# Altium schematic sheet MCU.SchDoc
size 420 x 297 mm; Address1: Address1; Address2: Address2; Address3: Address3; Address4: Address4; DocumentNumber: АБВГ.123456.001 Э3; SheetNumber: 2; Scale: 1:1; DocumentType: Схема электрическая принципиальная; FirstReferrence: АБВГ.123456.001
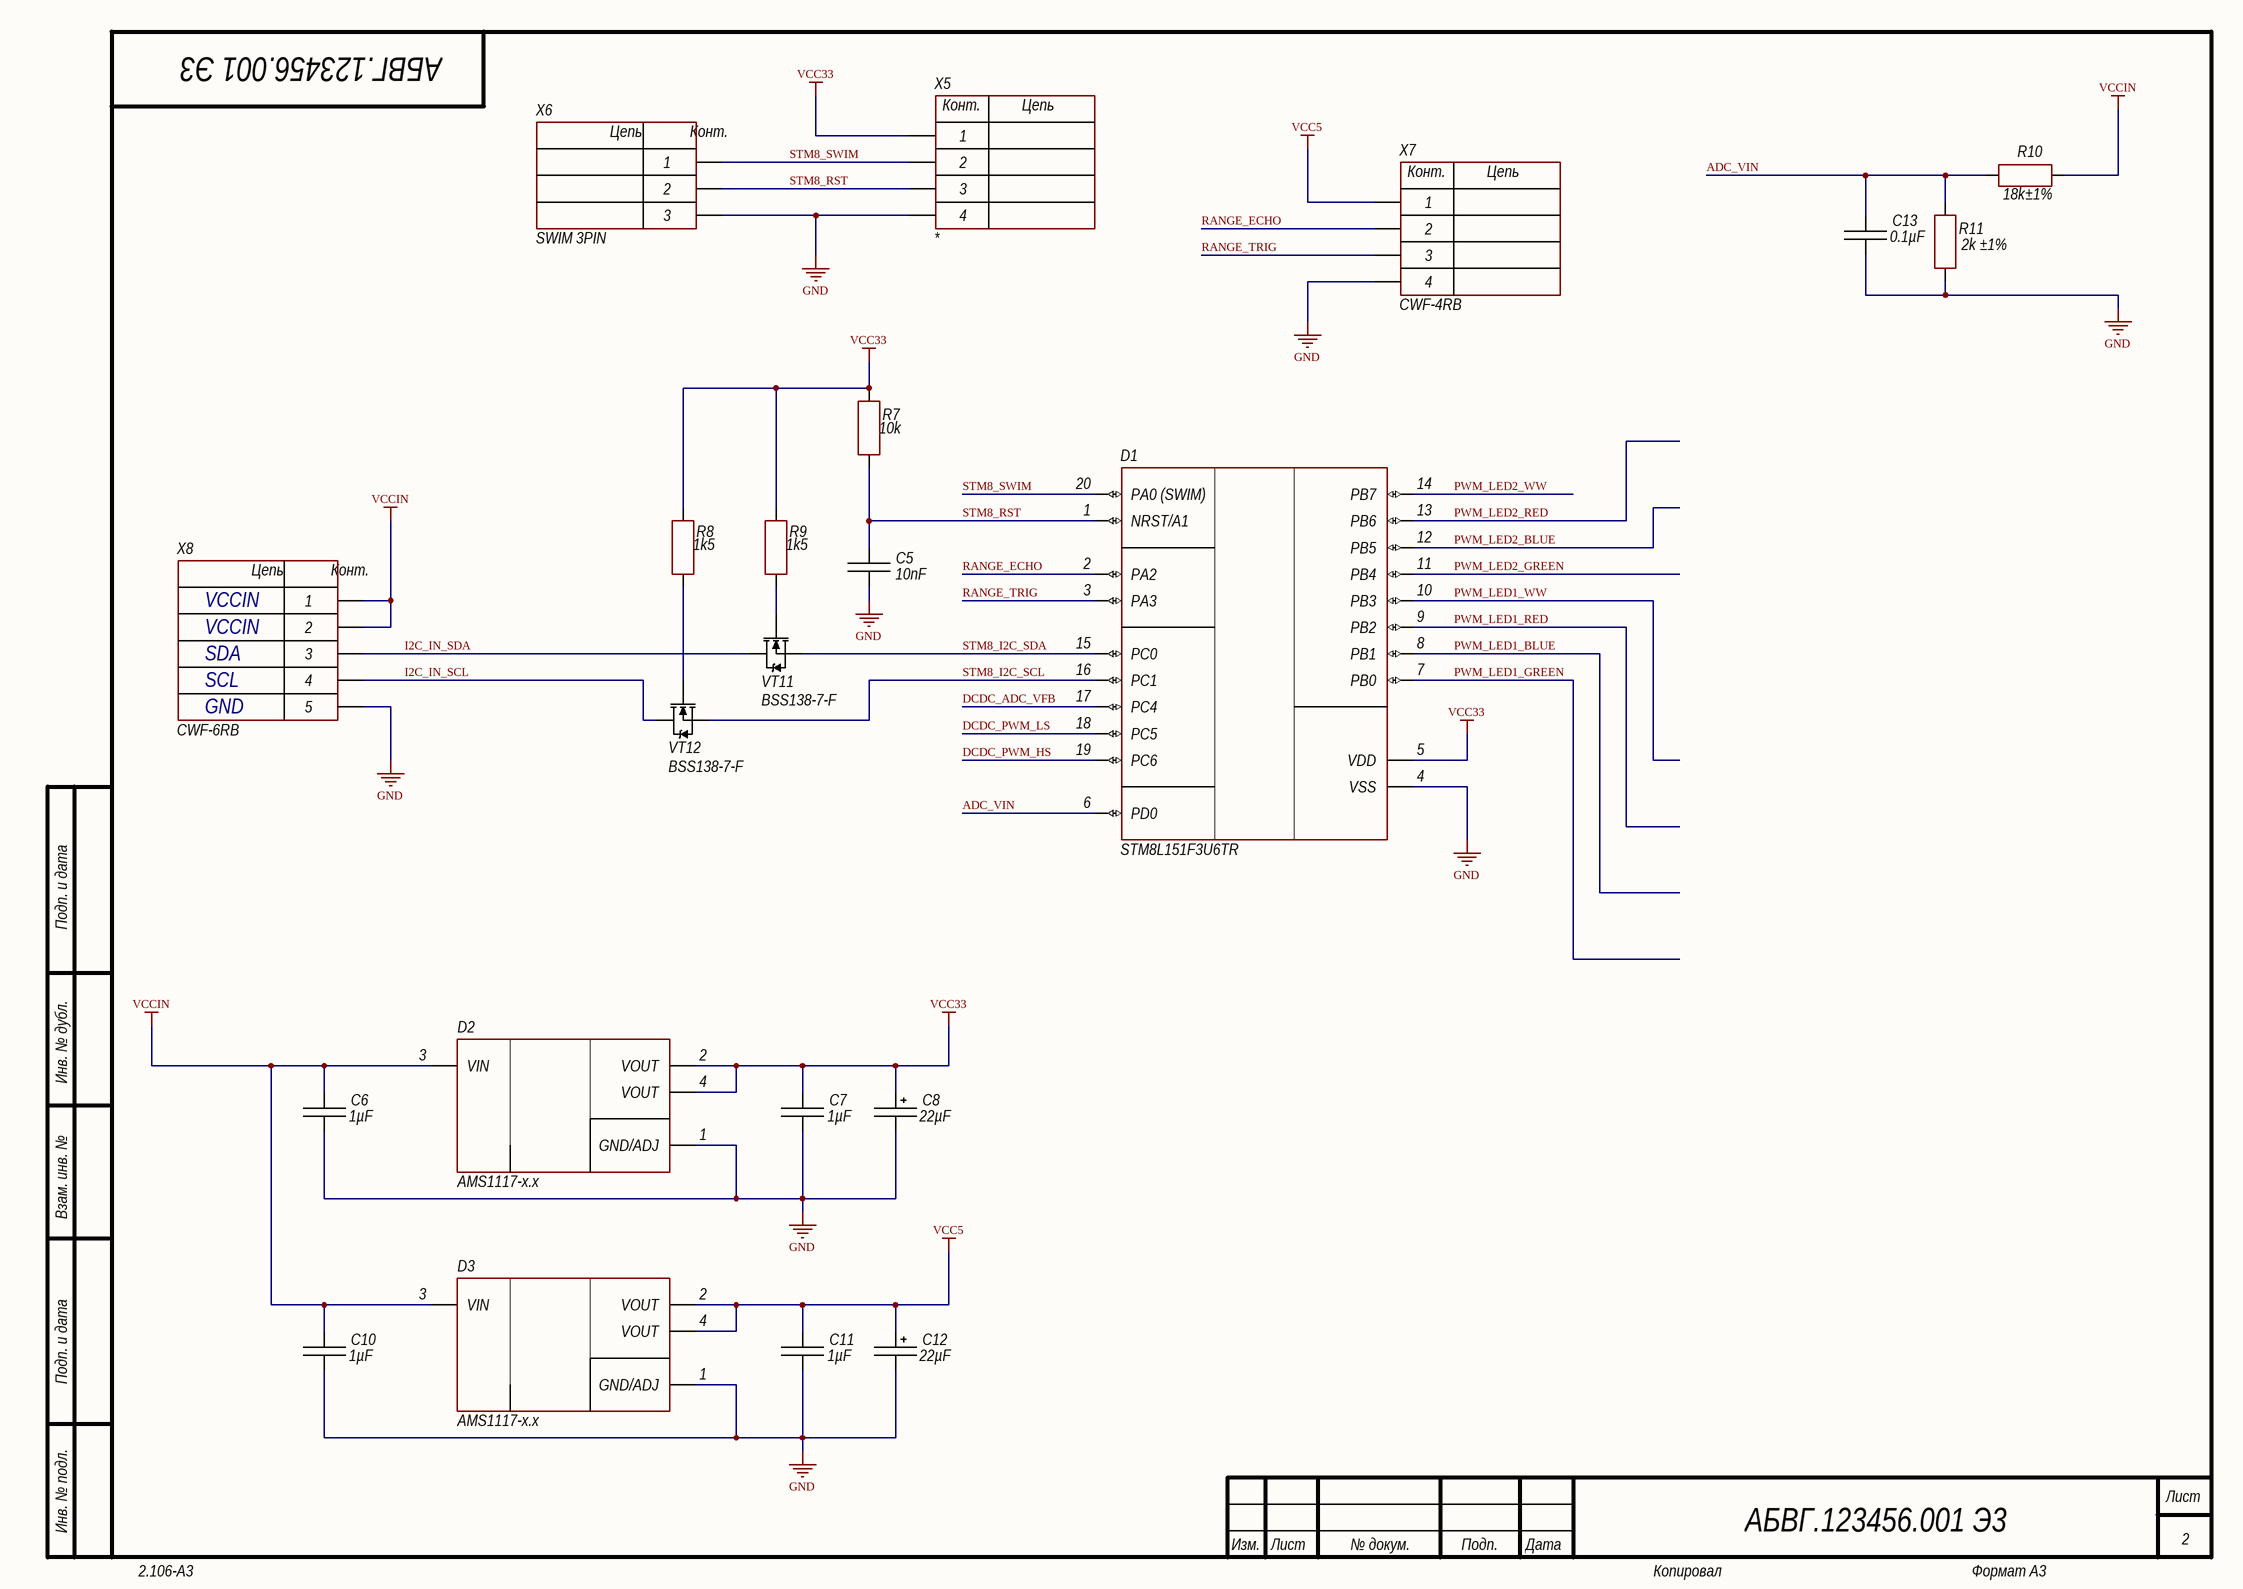
[diagram p0: MCU.SchDoc]

## Parts
C5  10nF  [CH0603C]
C6  1µF  [CH0603C]
C7  1µF  [CH0603C]
C8  22µF  [TANTAL_B]
C10  1µF  [CH0603C]
C11  1µF  [CH0603C]
C12  22µF  [TANTAL_B]
C13  0.1µF  [CH0603C]
D1  STM8L151F3U6TR  [20-UFQFPN]
D2  AMS1117-x.x  [SOT223]
D3  AMS1117-x.x  [SOT223]
R7  10k  [CH0603R]
R8  1k5  [CH0603R]
R9  1k5  [CH0603R]
R10  18k  ComponentKind: ±1%  [CH0603R]
R11  2k  ComponentKind: ±1%  [CH0603R]
VT11  BSS138-7-F  [SOT23_132]
VT12  BSS138-7-F  [SOT23_132]
X5  *  [CON: CWF-4RB]
X6  SWIM 3PIN  [CON: 3 PIN 1x1]
X7  CWF-4RB  [CON: CWF-4RB]
X8  CWF-6RB  [CON: CWF-5RB]

## Nets
GND: C5.1 C6.1 C7.1 C8.2 C10.1 C11.1 C12.2 C13.2 D1.4(VSS) D2.1(GND/ADJ) D3.1(GND/ADJ) R11.1 X5.4 X6.3 X7.4 X8.5
VCC5: C11.2 C12.1 D3.2(VOUT) D3.4(VOUT) X7.1
VCC33: C7.2 C8.1 D1.5(VDD) D2.2(VOUT) D2.4(VOUT) R7.2 R8.2 R9.2 X5.1
VCCIN: C6.2 C10.2 D2.3(VIN) D3.3(VIN) R10.2 X8.1 X8.2
ADC_VIN: C13.1 D1.6(PD0) R10.1 R11.2
DCDC_ADC_VFB: D1.17(PC4)
DCDC_PWM_HS: D1.19(PC6)
DCDC_PWM_LS: D1.18(PC5)
I2C_IN_SCL: VT12.2(D) X8.4
I2C_IN_SDA: VT11.2(D) X8.3
PWM_LED1_BLUE: D1.8(PB1)
PWM_LED1_GREEN: D1.7(PB0)
PWM_LED1_RED: D1.9(PB2)
PWM_LED1_WW: D1.10(PB3)
PWM_LED2_BLUE: D1.12(PB5)
PWM_LED2_GREEN: D1.11(PB4)
PWM_LED2_RED: D1.13(PB6)
PWM_LED2_WW: D1.14(PB7)
RANGE_ECHO: D1.2(PA2) X7.2
RANGE_TRIG: D1.3(PA3) X7.3
STM8_I2C_SCL: D1.16(PC1) VT12.3(S)
STM8_I2C_SDA: D1.15(PC0) VT11.3(S)
STM8_RST: C5.2 D1.1(NRST/A1) R7.1 X5.3 X6.2
STM8_SWIM: D1.20(PA0_(SWIM)) X5.2 X6.1
NetR8_1: R8.1 VT12.1(G)
NetR9_1: R9.1 VT11.1(G)

## Notes on the sheet
- VCCIN
- SDA
- SCL
- GND
- Подп. и дата
- Инв. № дубл.
- Взам. инв. №
- Инв. № подл.
- Изм.
- Лист
- № докум.
- Подп.
- Дата
- 2.106-A3
- Копировал
- Формат А3
- (in symbol 3-Connector) Цепь; Конт.
- (in symbol 4-Connector) Конт.; Цепь
- (in symbol 5-Connector) Цепь; Конт.

## Library data of the parts
C5 C13 = Capacitor: Manufacturer: *; Model: *; HelpURL: *; ComponentKind: *
  C5: Value: 10nF
  C13: Value: 0.1µF
C6 C7 C10 C11 = Capacitor: Manufacturer: Murata Electronics Inc.; Model: GRM188R71C105KE15D; HelpURL: https://www.terraelectronica.ru/product/2094261; ComponentKind: X5R; Value: 1µF
C8 C12 = TantalCap: Manufacturer: *; Model: *; HelpURL: *; ComponentKind: *; Value: 22µF
D1 = STM8L151F3U6TR: STM8; Manufacturer: ST Microelectronics; Model: STM8L151F3U6TR; ComponentKind: UFQFPN20; HelpURL: https://ru.mouser.com/ProductDetail/STMicroelectronics/STM8L151F3U6TR?qs=%2fha2pyFadujNatApb6mgzz%2fJ8pBCuKMdXUiFB4BdrxFB7btRjiLFjw%3d%3d
D2 D3 = AMS1117-x.x: Step-down; Manufacturer: Advanced Monolithic Systems; Model: AMS11117-X.X; HelpURL: http://www.advanced-monolithic.com/pdf/ds1117.pdf; ComponentKind: SOT-223
R7-R11 = Resistor: Manufacturer: *; Model: *; HelpURL: *
  R7: ComponentKind: *; Value: 10k
  R8 R9: ComponentKind: *; Value: 1k5
  R10: Value: 18k
  R11: Value: 2k
VT11 VT12 = N-chanel: Mosfet; Manufacturer: Diodes Incorporated; Model: BSS138-7-F; ComponentKind: 0.2А, 50В; HelpURL: https://static.chipdip.ru/lib/333/DOC003333982.pdf
X5 X7 = 4-Connector: Manufacturer: *; HelpURL: *; ComponentKind: *
  X5: Model: *
  X7: Model: CWF-4RB
X6 = 3-Connector: Model: SWIM 3PIN; Manufacturer: *; HelpURL: *; ComponentKind: *
X8 = 5-Connector: Model: CWF-6RB; Manufacturer: *; HelpURL: *; ComponentKind: *